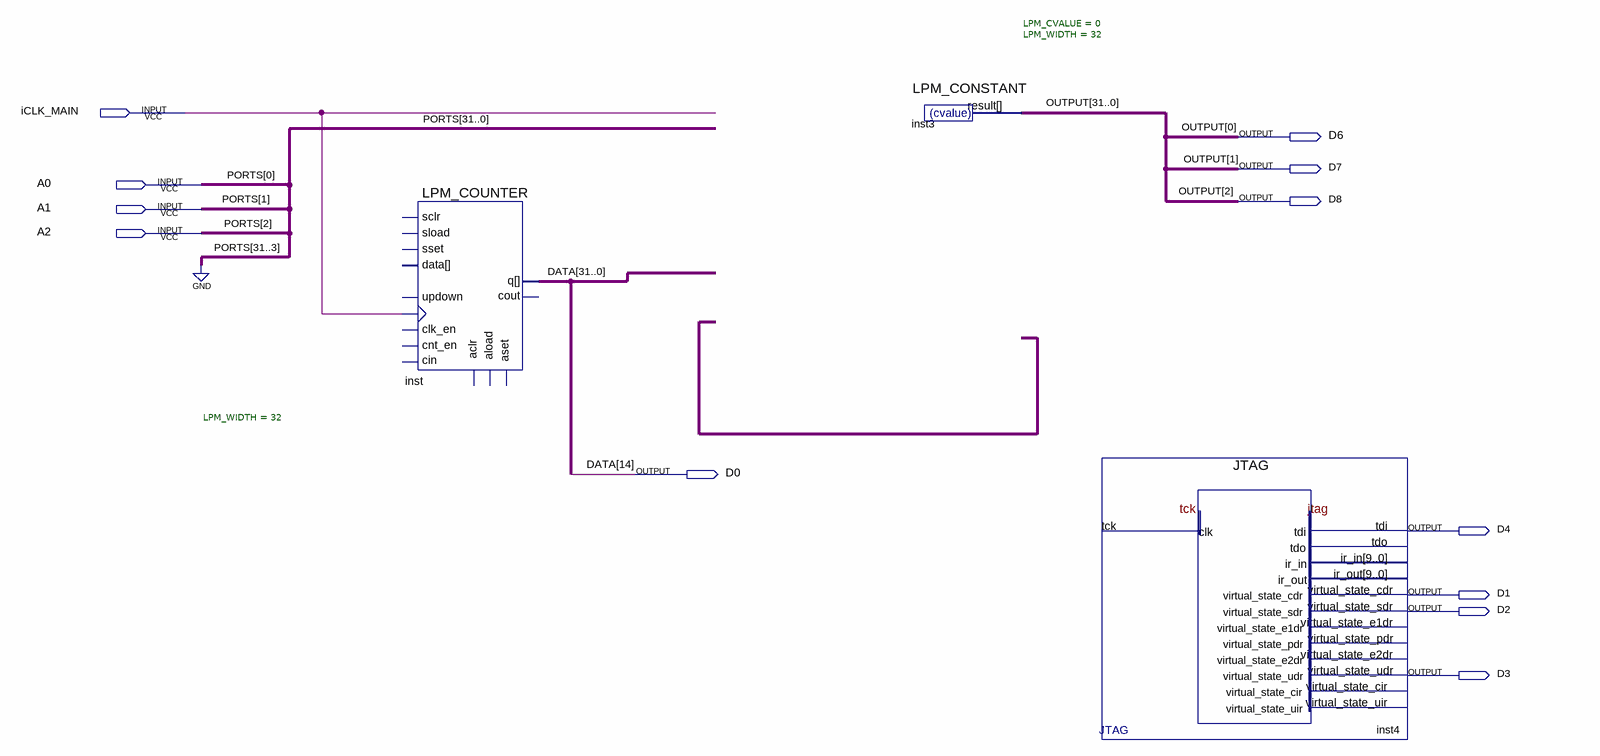
[diagram p0: schematic sheet]
// Quartus schematic MyDesign.bdf as structural Verilog: 3 symbols, 12 pins
module MyDesign (
  input  iCLK_MAIN,
  input  A0,
  input  A1,
  input  A2,
  output D6,
  output D7,
  output D8,
  output D0,
  output D4,
  output D1,
  output D2,
  output D3
);

  wire [31:0] DATA;
  wire [31:3] OUTPUT;

  LPM_COUNTER #(.LPM_WIDTH(32)) inst (
    .clock(iCLK_MAIN), .q({DATA[31:15], D0, DATA[13:0]}));  // open: sload, data, clk_en, aload, aclr, aset, cin, sset, updown, cnt_en, sclr, cout
  LPM_CONSTANT #(.LPM_CVALUE(0), .LPM_WIDTH(32)) inst3 (.result({OUTPUT, D8, D7, D6}));
  JTAG inst4 (
    .tdi(D4), .virtual_state_cdr(D1), .virtual_state_sdr(D2), .virtual_state_udr(D3));  // open: tdo, ir_out, ir_in, virtual_state_e1dr, virtual_state_pdr, virtual_state_e2dr, virtual_state_cir, virtual_state_uir, tck

  // Other names for the same wires on the sheet: DATA[14] = D0; OUTPUT[2:0] = {D8, D7, D6}; PORTS[2:0] = {A2, A1, A0}
endmodule
